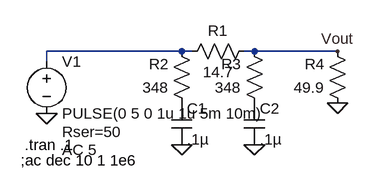
[diagram p0: schematic backplane_inputs_spice_model.asc]
backplane_inputs_spice_model.asc, the LTspice schematic file:
Version 4
SHEET 1 880 680
WIRE 256 96 48 96
WIRE 272 96 256 96
WIRE 368 96 352 96
WIRE 496 96 368 96
WIRE 48 112 48 96
FLAG 496 176 0
FLAG 496 96 Vout
FLAG 48 192 0
FLAG 256 240 0
FLAG 368 240 0
SYMBOL voltage 48 96 R0
WINDOW 123 24 152 Left 2
WINDOW 39 24 124 Left 2
SYMATTR InstName V1
SYMATTR Value PULSE(0 5 0 1u 1u 5m 10m)
SYMATTR Value2 AC 5
SYMATTR SpiceLine Rser=50
SYMBOL res 368 80 R90
WINDOW 0 0 56 VBottom 2
WINDOW 3 32 56 VTop 2
SYMATTR InstName R1
SYMATTR Value 14.7
SYMBOL res 272 192 R180
WINDOW 0 36 76 Left 2
WINDOW 3 36 40 Left 2
SYMATTR InstName R2
SYMATTR Value 348
SYMBOL res 384 192 R180
WINDOW 0 36 76 Left 2
WINDOW 3 36 40 Left 2
SYMATTR InstName R3
SYMATTR Value 348
SYMBOL res 512 192 R180
WINDOW 0 36 76 Left 2
WINDOW 3 36 40 Left 2
SYMATTR InstName R4
SYMATTR Value 49.9
SYMBOL cap 240 176 R0
SYMATTR InstName C1
SYMATTR Value .1µ
SYMBOL cap 352 176 R0
SYMATTR InstName C2
SYMATTR Value .1µ
TEXT 14 240 Left 2 !.tran .1
TEXT 8 264 Left 2 !;ac dec 10 1 1e6

The netlist it stands for:
* backplane_inputs_spice_model.asc
V1 N001 0 PULSE(0 5 0 1u 1u 5m 10m) AC 5 Rser=50
R1 Vout N001 14.7
R2 P001 N001 348
R3 P002 Vout 348
R4 0 Vout 49.9
C1 P001 0 .1µ
C2 P002 0 .1µ
.tran .1
;ac dec 10 1 1e6
.backanno
.end